# EAGLE design imu_breakout (EAGLE 9.0.1)
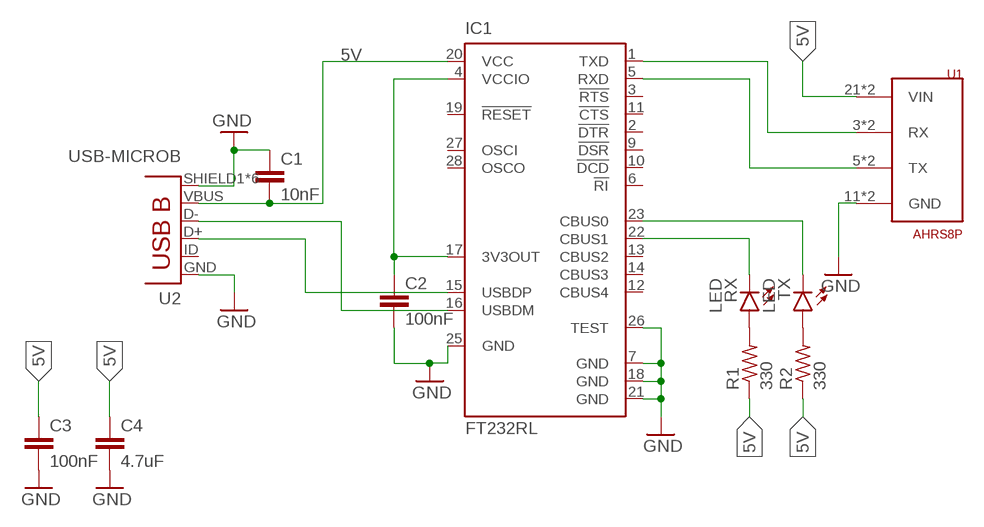
[diagram p0: schematic, sheet 1]

## Parts
C1  10nF  C-EUC0603  [C0603]
C2  100nF  C-EUC0603  [C0603]
C3  100nF  C-EUC0603  [C0603]
C4  4.7uF  C-EUC0603  [C0603]
IC1  FT232RL  [SSOP28]
R1  330  R-US_R0603  [R0603]
R2  330  R-US_R0603  [R0603]
RX  LED  [LED-0603]
TX  LED  [LED-0603]
U1  AHRS8P_CONN  [ST4-10-1.00-L-D-P-TR]
U2  USB-MICROB  [USB-B-MICRO-SMD]

## Nets
3V3OUT: C2.1 IC1.4(VCCIO) IC1.17(3V3OUT)
5V: C1.2 C3.1 C4.1 IC1.20(VCC) R1.1 R2.1 U1.21(VIN) U1.22(VIN) U2.VBUS
GND: C1.1 C2.2 C3.2 C4.2 IC1.7(GND) IC1.18(GND) IC1.21(GND) IC1.25(GND) IC1.26(TEST) U1.11(GND) U1.12(GND) U2.GND U2.SHIELD1(SHIELD) U2.SHIELD2(SHIELD) U2.SHIELD3(SHIELD) U2.SHIELD4(SHIELD) U2.SHIELD5(SHIELD) U2.SHIELD6(SHIELD)
IMU_RX: IC1.1(TXD) U1.3(RX) U1.4(RX)
IMU_TX: IC1.5(RXD) U1.5(TX) U1.6(TX)
N$6: R1.2 RX.A
N$7: R2.2 TX.A
RX_LED: IC1.22(CBUS1) RX.C
TX_LED: IC1.23(CBUS0) TX.C
USBDM: IC1.16(USBDM) U2.D-
USBDP: IC1.15(USBDP) U2.D+
Unconnected: IC1.2(!DTR) IC1.3(!RTS) IC1.6(!RI) IC1.9(!DSR) IC1.10(!DCD) IC1.11(!CTS) IC1.12(CBUS4) IC1.13(CBUS2) IC1.14(CBUS3) IC1.19(!RESET) IC1.27(OSCI) IC1.28(OSCO) U2.ID(USBID)

## Library data of the parts
C1-C4 = auv:C-EU: CAPACITOR, European symbol
IC1 = auv:FT232R: Source: http://www.ftdichip.com/Documents/DataSheets/DS_FT232R_v104.pdf; MPN: FT232RL; OC_FARNELL: 1146032; OC_NEWARK: 91K9918
R1 R2 = auv:R-US_: RESISTOR, American symbol
RX TX = auv:LED
U1 = auv:AHRS8P_CONN
U2 = auv:USB-MICROB

## Board
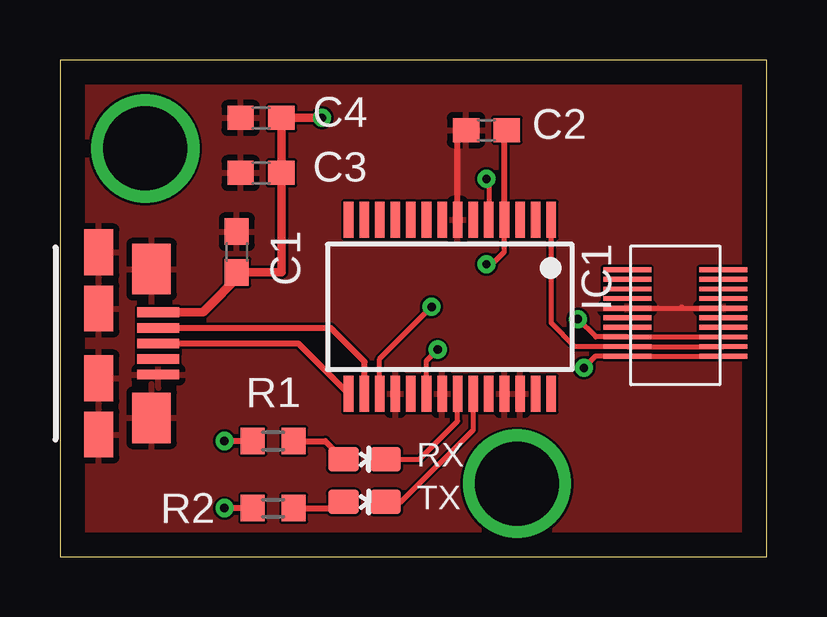
[diagram p1: board, top side]
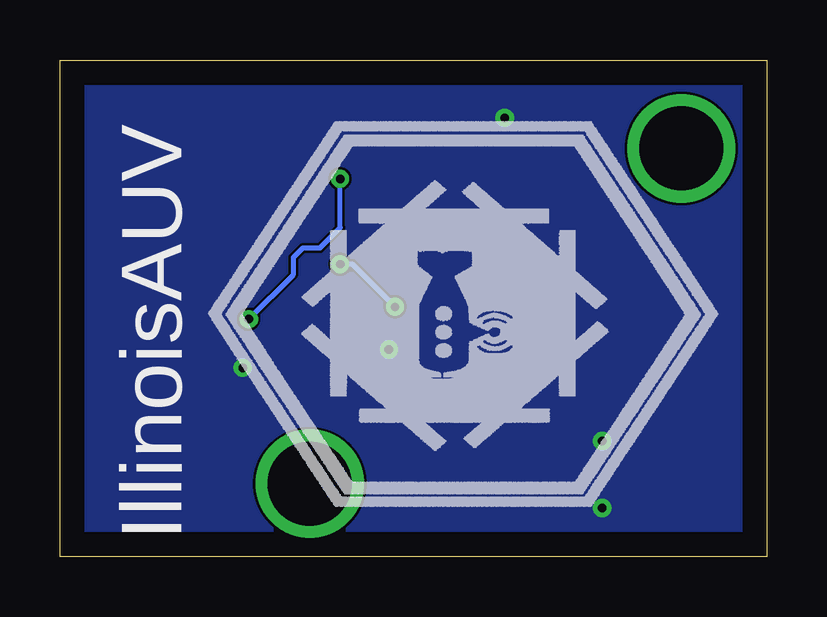
[diagram p2: board, bottom side, seen from below]

Size 29.46 x 20.7 mm. Coordinates in mm from the lower left corner, seen from the top.
Outline: 0,0 29.46,0 29.46,20.7 0,20.7 0,0
Copper layers (1*16): Top 0.035mm / dielectric 1.5mm / Bottom 0.035mm
Design rules "PCBway *": minimum track width 6mil, minimum drill 0.3mm, track to track 4mil, track to pad 0.205mm, pad to pad 0.205mm, via to via 0.205mm, smd to smd 8mil, copper to edge 40mil, drill to drill 8mil, minimum pad ring 10mil, minimum via ring 8mil, stop-mask expansion 4mil, vias tented up to drill 25mil, thermal gap 10mil

### Footprints (pad centres in the part's own frame; a part is rotated, then mirrored left to right if it is on the bottom)
C0603 = smd 1.1 x 1: 1 -0.85,0; 2 0.85,0
SSOP28 = smd 0.4 x 1.5: 1 -4.225,-3.625; 2 -3.575,-3.625; 3 -2.925,-3.625; 4 -2.275,-3.625; 5 -1.625,-3.625; 6 -0.975,-3.625; 7 -0.325,-3.625; 8 0.325,-3.625; 9 0.975,-3.625; 10 1.625,-3.625; 11 2.275,-3.625; 12 2.925,-3.625; 13 3.575,-3.625; 14 4.225,-3.625; 15 4.225,3.625; 16 3.575,3.625; 17 2.925,3.625; 18 2.275,3.625; 19 1.625,3.625; 20 0.975,3.625; 21 0.325,3.625; 22 -0.325,3.625; 23 -0.975,3.625; 24 -1.625,3.625; 25 -2.275,3.625; 26 -2.925,3.625; 27 -3.575,3.625; 28 -4.225,3.625
R0603 = smd 1 x 1.1: 1 -0.85,0; 2 0.85,0
LED-0603 = smd 1.016 x 1.27: A 0,-0.877; C 0,0.877
ST4-10-1.00-L-D-P-TR = smd 0.2 x 2: 3 1.4,2; 4 1.4,-2; 5 1,2; 6 1,-2; 7 0.6,2; 8 0.6,-2; 9 0.2,2; 10 0.2,-2; 11 -0.2,2; 12 -0.2,-2; 13 -0.6,2; 14 -0.6,-2; 15 -1,2; 16 -1,-2; 17 -1.4,2; 18 -1.4,-2; 19 -1.8,2; 20 -1.8,-2; 21 1.8,2; 22 1.8,-2
USB-B-MICRO-SMD = smd 0.4 x 1.75: D+ 0,2.825; D- -0.65,2.825; GND 1.3,2.825; ID 0.65,2.825; VBUS -1.3,2.825 | smd 2.1 x 1.6: SHIELD1 3.1,2.55; SHIELD2 -3.1,2.55 | smd 1.9 x 1.2: SHIELD3 -3.8,0.35; SHIELD4 -1.45,0.35; SHIELD5 1.45,0.35; SHIELD6 3.8,0.35

### Placement (x,y rotation side)
C1  7.37,12.7 270 top
C2  17.78,17.78 180 top
C3  8.38,16 180 top
C4  8.38,18.29 180 top
IC1  16.26,10.41 180 top
R1  8.89,4.83 0 top
R2  8.89,2.03 0 top
RX  12.7,4.06 270 top
TX  12.7,2.29 270 top
U1  25.65,10.16 270 top
U2  1.27,8.89 270 top
U$1  [ILLINOISAUV]  14.22,9.14 270 bottom

### Tracks (layer width: path | path; a pad name or v marks a point on that pad's centre or on a via)
3V3OUT  (via drill 0.35)
  Top 0.203: IC1.17 13.33,8.25 v15.49,10.41 | IC1.4 18.53,12.71 18.01,12.19 v17.78,12.19
  Top 0.254: IC1.4 18.53,17.68 C2.1
  Bottom 0.203: v15.49,10.41 17.27,12.19 v17.78,12.19
5V  (via drill 0.35)
  Top 0.203: U1.22 U1.21 | IC1.20 15.28,8.17 v15.75,8.64 | U1.22 23.35,8.36 | U1.22 22.33,8.36 v21.84,7.87
  Top 0.254: R1.1 v6.86,4.83 | R2.1 v6.86,2.03
  Top 0.356: U2.VBUS 5.96,10.19 7.62,11.85 C1.2 9.23,11.85 C3.1 C4.1 v10.92,18.29
  pour Bottom: 36.07,20.83 0,20.83 0,0 36.07,0
GND
  Top 0.203: 24.95,10.36 U1.12 U1.11 | 25.96,10.36 25.91,10.41
  Top 0.254: IC1.7 16.58,17.43 C2.2
  pour Top (rank 6): 0,20.83 30.23,20.83 30.23,0 0,0
IMU_RX
  Top 0.203: U1.3 U1.4 21.47,8.76 20.48,9.74 IC1.1
IMU_TX  (via drill 0.35)
  Top 0.203: U1.6 U1.5 | U1.6 23.1,9.16 | v17.78,15.75 17.88,15.65 IC1.5 | U1.6 22.34,9.16 v21.59,9.91
  Bottom 0.203: v21.59,9.91 19.73,11.76 19.73,12.48 19.33,12.88 18.62,12.88 17.78,13.72 v17.78,15.75
N$1  (via drill 3.5)
  other vias: 19.05,3.05
N$2  (via drill 3.5)
  other vias: 3.56,17.02
N$6
  Top 0.254: R1.2 11.06,4.83 RX.A
N$7
  Top 0.254: R2.2 11.57,2.03 TX.A
RX_LED
  Top 0.203: RX.C 14.99,4.06 16.58,5.66 IC1.22
TX_LED
  Top 0.203: TX.C 14.22,2.29 17.23,5.29 IC1.23
USBDM
  Top 0.254: U2.D- 11.29,9.54 12.7,8.13 12.68,8.11 IC1.16
USBDP
  Top 0.254: U2.D+ 9.93,8.89 IC1.15